# EAGLE design spdif_A (EAGLE 7.7.0)

## Sheet 1 of 2
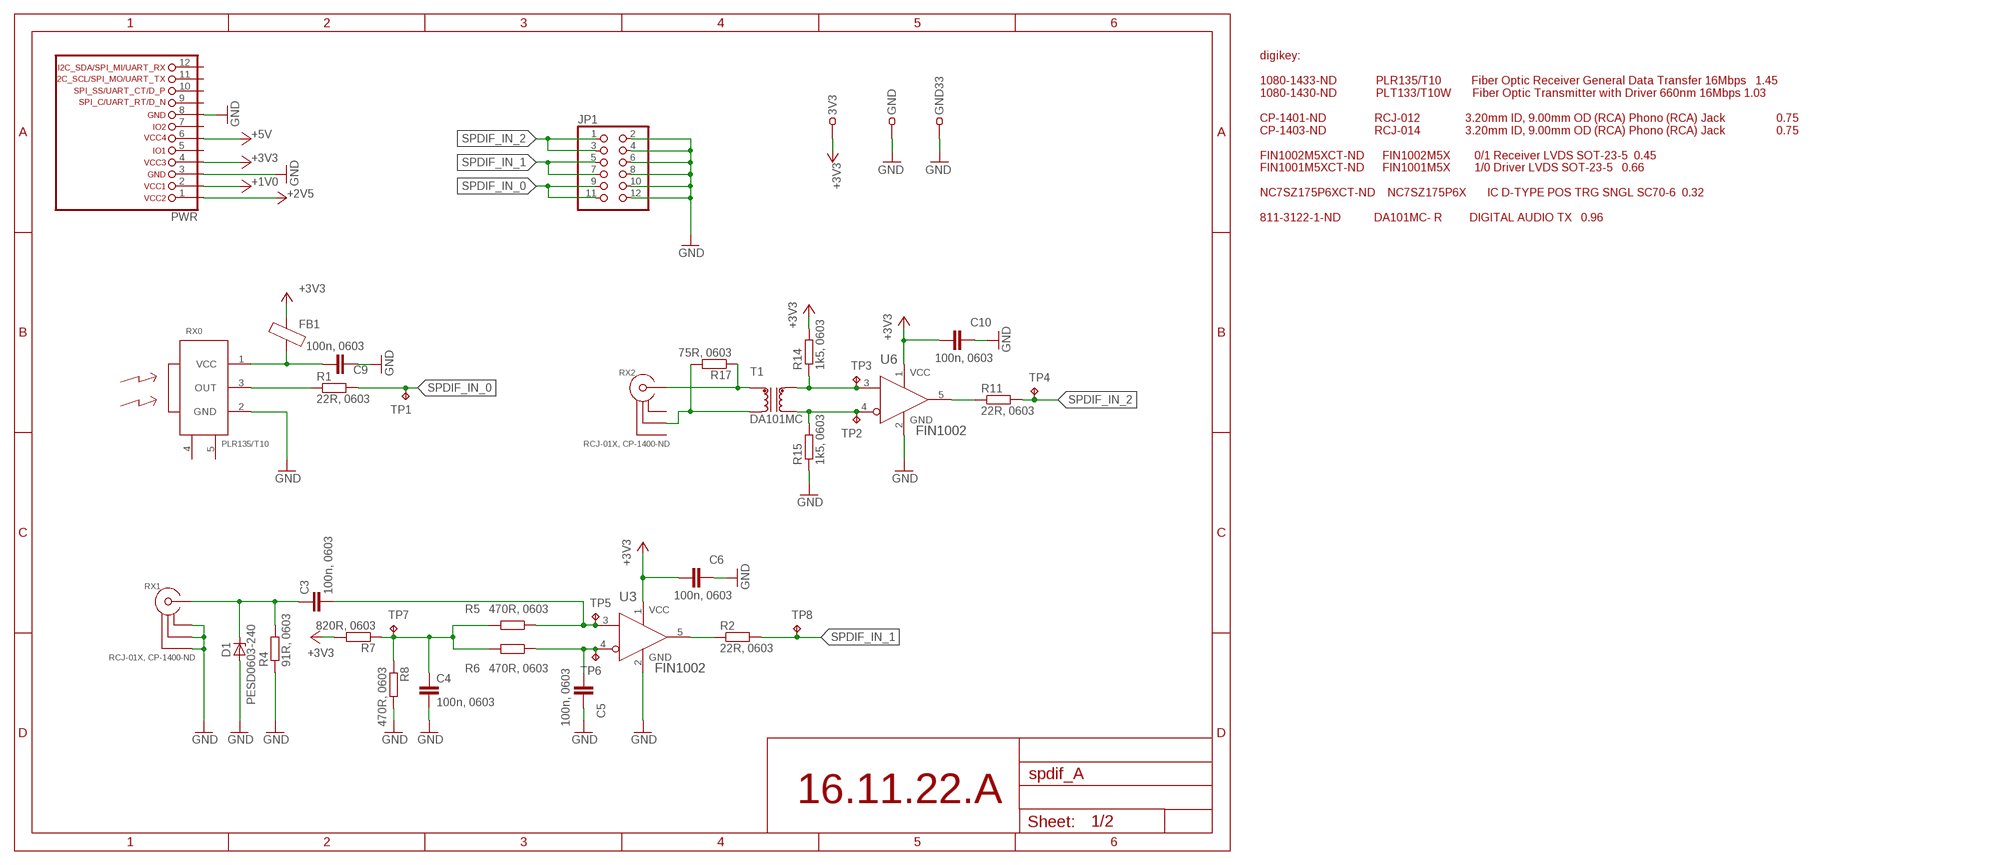
[diagram p0: schematic, sheet 1]

### Parts
3V3  TEST-22-MULTICOMP  [TEST_1MM]
C3  100n, 0603  C-EUC0603  [C0603]
C4  100n, 0603  C-EUC0603  [C0603]
C5  100n, 0603  C-EUC0603  [C0603]
C6  100n, 0603  C-EUC0603  [C0603]
C9  100n, 0603  C-EUC0603  [C0603]
C10  100n, 0603  C-EUC0603  [C0603]
D1  PESD0603-240  ZDPESD0603-240  [L0603]
FB1  FB_0603  [L0603]
GND  TEST-22-MULTICOMP  [TEST_1MM]
GND33  TEST-22-MULTICOMP  [TEST_1MM]
JP1  PINHD-2X6/90  [2X06/90]
PWR  LIWE_12_PIN_PWR7X7_COMPAT  [LIWE_12_PIN_7X7_COMPAT]
R1  22R, 0603  R-EU_R0603  [R0603]
R2  22R, 0603  R-EU_R0603  [R0603]
R4  91R, 0603  R-EU_R0603  [R0603]
R5  470R, 0603  R-EU_R0603  [R0603]
R6  470R, 0603  R-EU_R0603  [R0603]
R7  820R, 0603  R-EU_R0603  [R0603]
R8  470R, 0603  R-EU_R0603  [R0603]
R11  22R, 0603  R-EU_R0603  [R0603]
R14  1k5, 0603  R-EU_R0603  [R0603]
R15  1k5, 0603  R-EU_R0603  [R0603]
R17  75R, 0603  R-EU_R0603  [R0603]
RX0  PLR135/T10  PLR135_T10  [PLR135_T10]
RX1  RCJ-01X, CP-1400-ND  RCJ-01X  [RCJ-01X]
RX2  RCJ-01X, CP-1400-ND  RCJ-01X  [RCJ-01X]
T1  DA101MC  [DA101MC]
TP1  TPB1,27  [B1,27]
TP2  TPB1,27  [B1,27]
TP3  TPB1,27  [B1,27]
TP4  TPB1,27  [B1,27]
TP5  TPB1,27  [B1,27]
TP6  TPB1,27  [B1,27]
TP7  TPB1,27  [B1,27]
TP8  TPB1,27  [B1,27]
U3  FIN1002  [SOT95P280X140-5N]
U6  FIN1002  [SOT95P280X140-5N]

### Nets
+1V0: PWR.2
+2V5: PWR.1
+3V3: 3V3.1 C6.2 C10.2 FB1.2 PWR.4 R7.2 R14.2 U3.1(VCC) U6.1(VCC) ; also sheet 2
+5V: PWR.6
GND: C4.2 C5.1 C6.1 C9.1 C10.1 D1.1(A) GND33.1 GND.1 JP1.2 JP1.4 JP1.6 JP1.8 JP1.10 JP1.12 PWR.3 PWR.8 R4.1 R8.2 R15.1 RX0.2(GND) RX1.20(GND1) RX1.21(GND2) RX1.22(GND3) U3.2(GND) U6.2(GND) ; also sheet 2
N$3: R2.1 U3.5(ROUT)
N$4: C3.2 R5.1 TP5.TP U3.3(RIN+)
N$5: C9.2 FB1.1 RX0.1(VCC)
N$6: C3.1 D1.2(C) R4.2 RX1.1(SIG)
N$7: R11.1 U6.5(ROUT)
N$11: C4.1 R5.2 R6.2 R7.1 R8.1 TP7.TP
N$12: C5.2 R6.1 TP6.TP U3.4(RIN-)
N$16: R15.2 T1.4 TP2.TP U6.4(RIN-)
N$17: R14.1 T1.6 TP3.TP U6.3(RIN+)
N$20: R17.2 RX2.21(GND2) T1.3
N$21: R17.1 RX2.1(SIG) T1.1
SPDIF0_IN: R1.1 RX0.3(OUT)
SPDIF_IN_0: JP1.9 JP1.11 R1.2 TP1.TP
SPDIF_IN_1: JP1.5 JP1.7 R2.2 TP8.TP
SPDIF_IN_2: JP1.1 JP1.3 R11.2 TP4.TP
Unconnected: PWR.5 PWR.7 PWR.9 PWR.10 PWR.11 PWR.12 RX0.4(NC0) RX0.5(NC1) RX2.20(GND1) RX2.22(GND3)

### Notes on the sheet
- digikey: 
  
  1080-1433-ND             PLR135/T10          Fiber Optic Receiver General Data Transfer 16Mbps  	1.45
  1080-1430-ND             PLT133/T10W       Fiber Optic Transmitter with Driver 660nm 16Mbps	1.03
  
  CP-1401-ND                RCJ-012               3.20mm ID, 9.00mm OD (RCA) Phono (RCA) Jack                 0.75
  CP-1403-ND                RCJ-014               3.20mm ID, 9.00mm OD (RCA) Phono (RCA) Jack                 0.75
  
  FIN1002M5XCT-ND      FIN1002M5X        0/1 Receiver LVDS SOT-23-5		0.45
  FIN1001M5XCT-ND      FIN1001M5X        1/0 Driver LVDS SOT-23-5			0.66
  
  NC7SZ175P6XCT-ND    NC7SZ175P6X       IC D-TYPE POS TRG SNGL SC70-6		0.32
  
  811-3122-1-ND           DA101MC- R         DIGITAL AUDIO TX			0.96
- 16.11.22.A

## Sheet 2 of 2
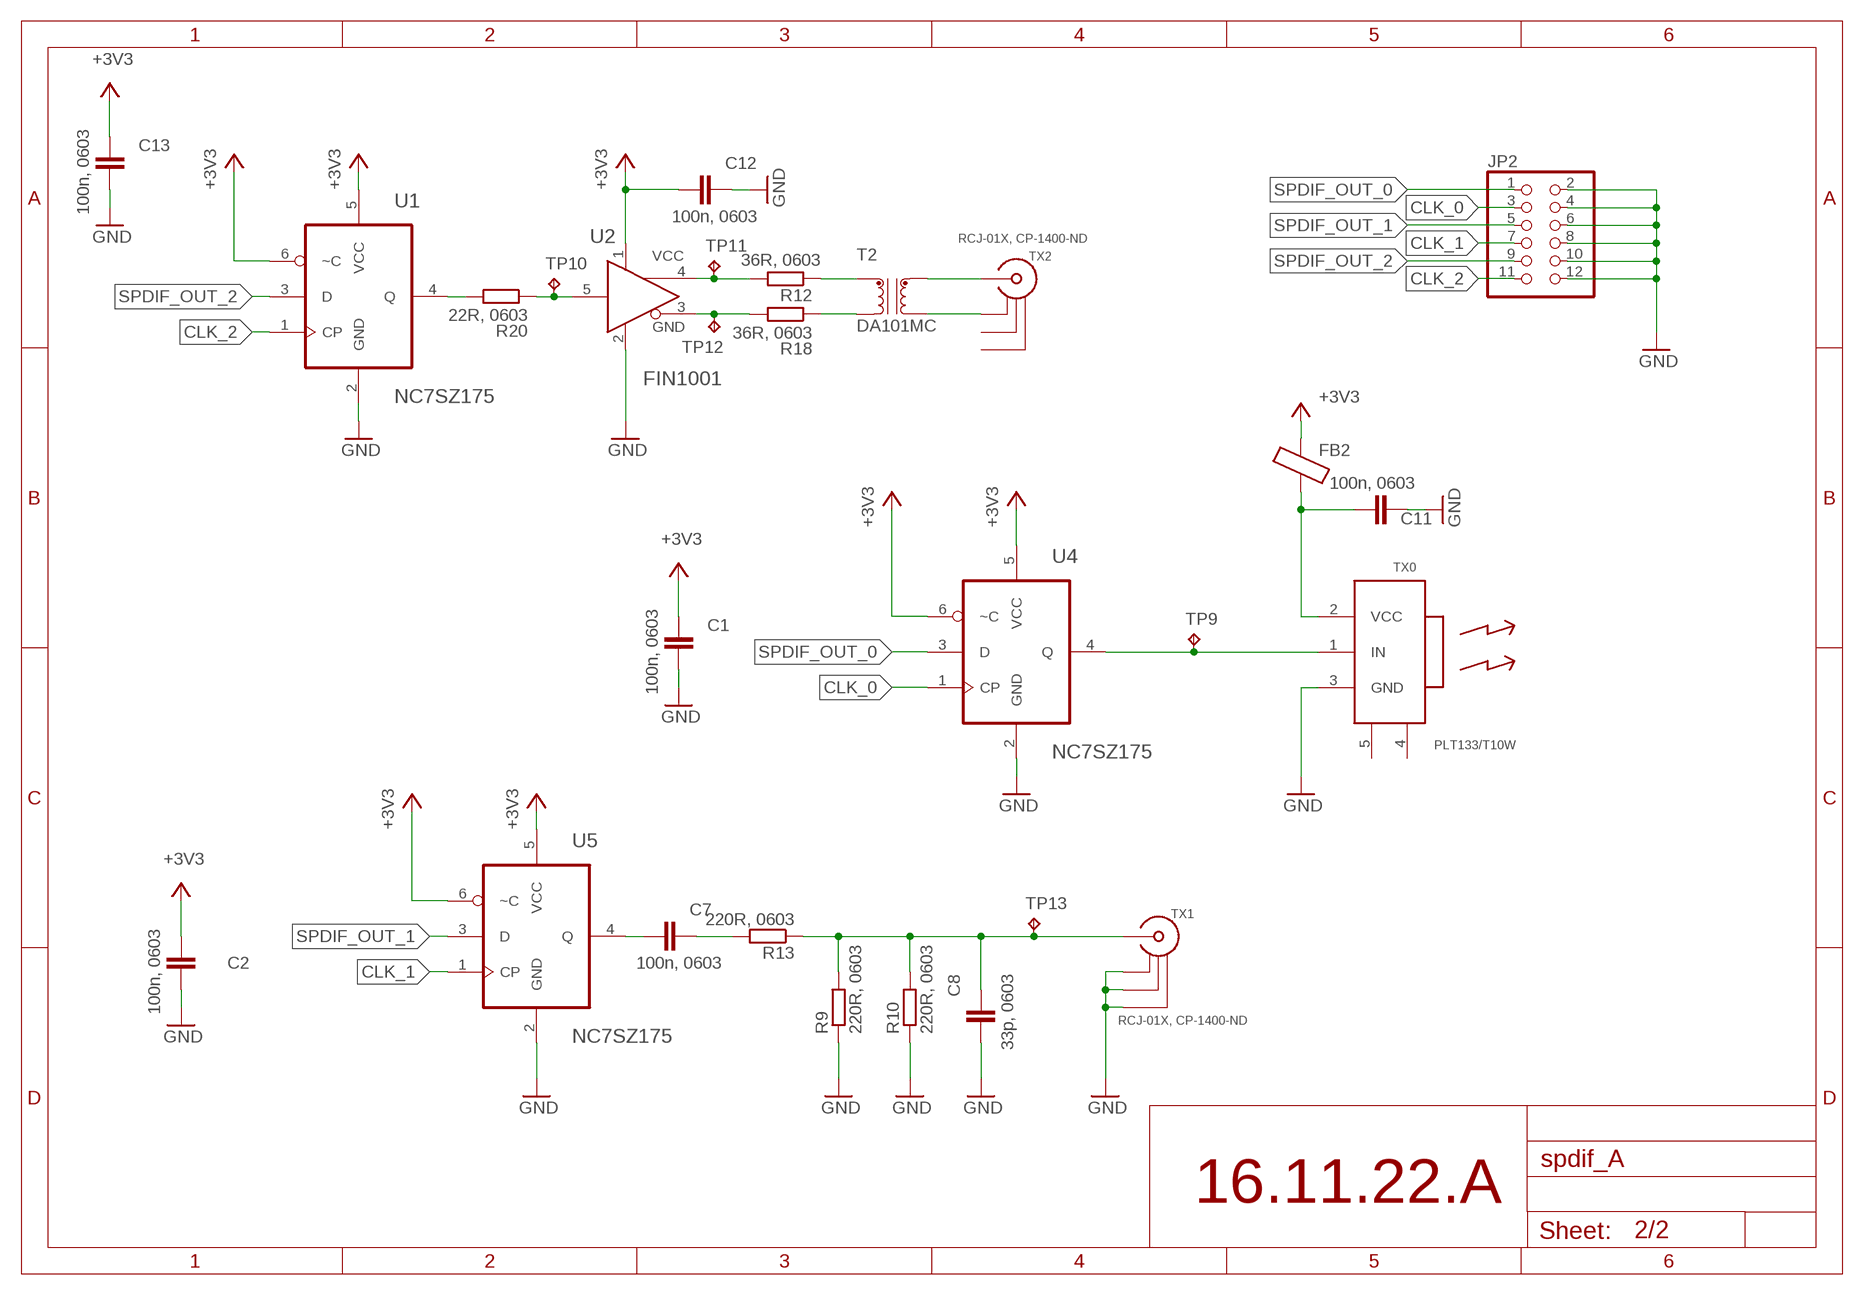
[diagram p1: schematic, sheet 2]

### Parts
C1  100n, 0603  C-EUC0603  [C0603]
C2  100n, 0603  C-EUC0603  [C0603]
C7  100n, 0603  C-EUC0603  [C0603]
C8  33p, 0603  C-EUC0603  [C0603]
C11  100n, 0603  C-EUC0603  [C0603]
C12  100n, 0603  C-EUC0603  [C0603]
C13  100n, 0603  C-EUC0603  [C0603]
FB2  FB_0603  [L0603]
JP2  PINHD-2X6/90  [2X06/90]
R9  220R, 0603  R-EU_R0603  [R0603]
R10  220R, 0603  R-EU_R0603  [R0603]
R12  36R, 0603  R-EU_R0603  [R0603]
R13  220R, 0603  R-EU_R0603  [R0603]
R18  36R, 0603  R-EU_R0603  [R0603]
R20  22R, 0603  R-EU_R0603  [R0603]
T2  DA101MC  [DA101MC]
TP9  TPB1,27  [B1,27]
TP10  TPB1,27  [B1,27]
TP11  TPB1,27  [B1,27]
TP12  TPB1,27  [B1,27]
TP13  TPB1,27  [B1,27]
TX0  PLT133/T10W  PLT133_T10W  [PLT133_T10W]
TX1  RCJ-01X, CP-1400-ND  RCJ-01X  [RCJ-01X]
TX2  RCJ-01X, CP-1400-ND  RCJ-01X  [RCJ-01X]
U1  NC7SZ175  [SOT65P210X110-6N]
U2  FIN1001  [SOT95P280X140-5N]
U4  NC7SZ175  [SOT65P210X110-6N]
U5  NC7SZ175  [SOT65P210X110-6N]

### Nets
+3V3: C1.2 C2.2 C12.2 C13.2 FB2.2 U1.5(VCC) U1.6(~C) U2.1(VCC) U4.5(VCC) U4.6(~C) U5.5(VCC) U5.6(~C) ; also sheet 1
CLK_0: JP2.3 U4.1(CP)
CLK_1: JP2.7 U5.1(CP)
CLK_2: JP2.11 U1.1(CP)
DA_N: R18.1 T2.3
DA_P: R12.1 T2.1
FIN_IN: R20.1 TP10.TP U2.5(RIN)
FIN_OUT_N: R18.2 TP12.TP U2.3(ROUT-)
FIN_OUT_P: R12.2 TP11.TP U2.4(ROUT+)
GND: C1.1 C2.1 C8.2 C11.1 C12.1 C13.1 JP2.2 JP2.4 JP2.6 JP2.8 JP2.10 JP2.12 R9.1 R10.1 TX0.3(GND) TX1.20(GND1) TX1.21(GND2) TX1.22(GND3) U1.2(GND) U2.2(GND) U4.2(GND) U5.2(GND) ; also sheet 1
N$8: C8.1 R9.2 R10.2 R13.1 TP13.TP TX1.1(SIG)
N$13: C7.1 R13.2
N$15: C7.2 U5.4(Q)
Q: R20.2 U1.4(Q)
SPDIF_OUT_0: JP2.1 U4.3(D)
SPDIF_OUT_1: JP2.5 U5.3(D)
SPDIF_OUT_2: JP2.9 U1.3(D)
TX0_IN: TP9.TP TX0.1(IN) U4.4(Q)
TX0_VCC: C11.2 FB2.1 TX0.2(VCC)
TX2_N: T2.4 TX2.20(GND1)
TX2_P: T2.6 TX2.1(SIG)
Unconnected: TX0.4(NC0) TX0.5(NC1) TX2.21(GND2) TX2.22(GND3)

### Notes on the sheet
- 16.11.22.A

## Library data of the parts
3V3 GND GND33 = 25cmsquare:TEST-22-MULTICOMP: MULTICOMP TEST-22 TEST PIN, PCB, 1.0MM FARNELL: 1702010
C1-C13 = rcl:C-EU: CAPACITOR, European symbol
D1 = 25cmsquare:ZD
FB1 FB2 = 25cmsquare:FB
JP1 JP2 = 25pinhead:PINHD-2X6: PIN HEADER
PWR = 25cmsquare:LIWE_12_PIN_PWR
R1 R2 R4-R15 R17 R18 R20 = rcl:R-EU_: RESISTOR, European symbol
RX0 = 25cmsquare:PLR135_T10
RX1 RX2 TX1 TX2 = 25cmsquare:RCJ-01X
T1 T2 = 25cmsquare:DA
TP1-TP13 = testpad:TP: Test pad
TX0 = 25cmsquare:PLT133_T10W
U1 U4 U5 = 25cmsquare:NC7SZ175
U2 = 25cmsquare:FIN1001
U3 U6 = 25cmsquare:FIN1002

## Board
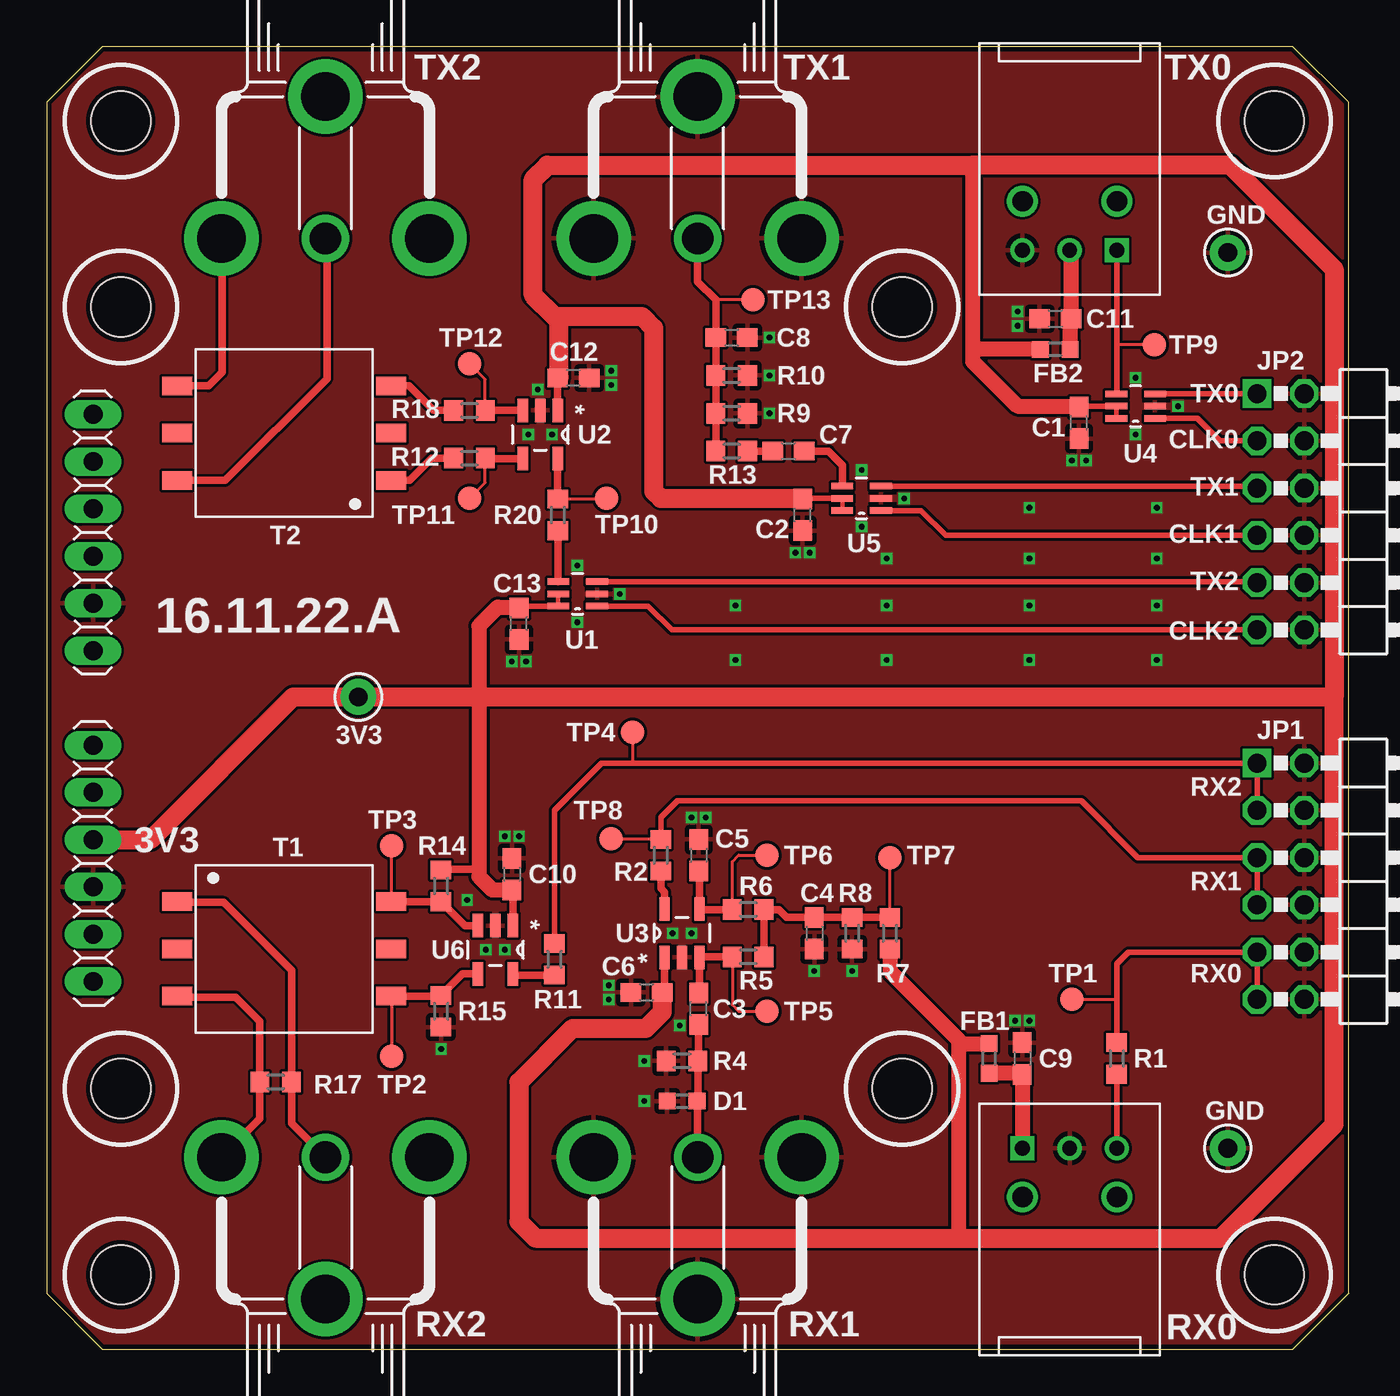
[diagram p2: board, top side]
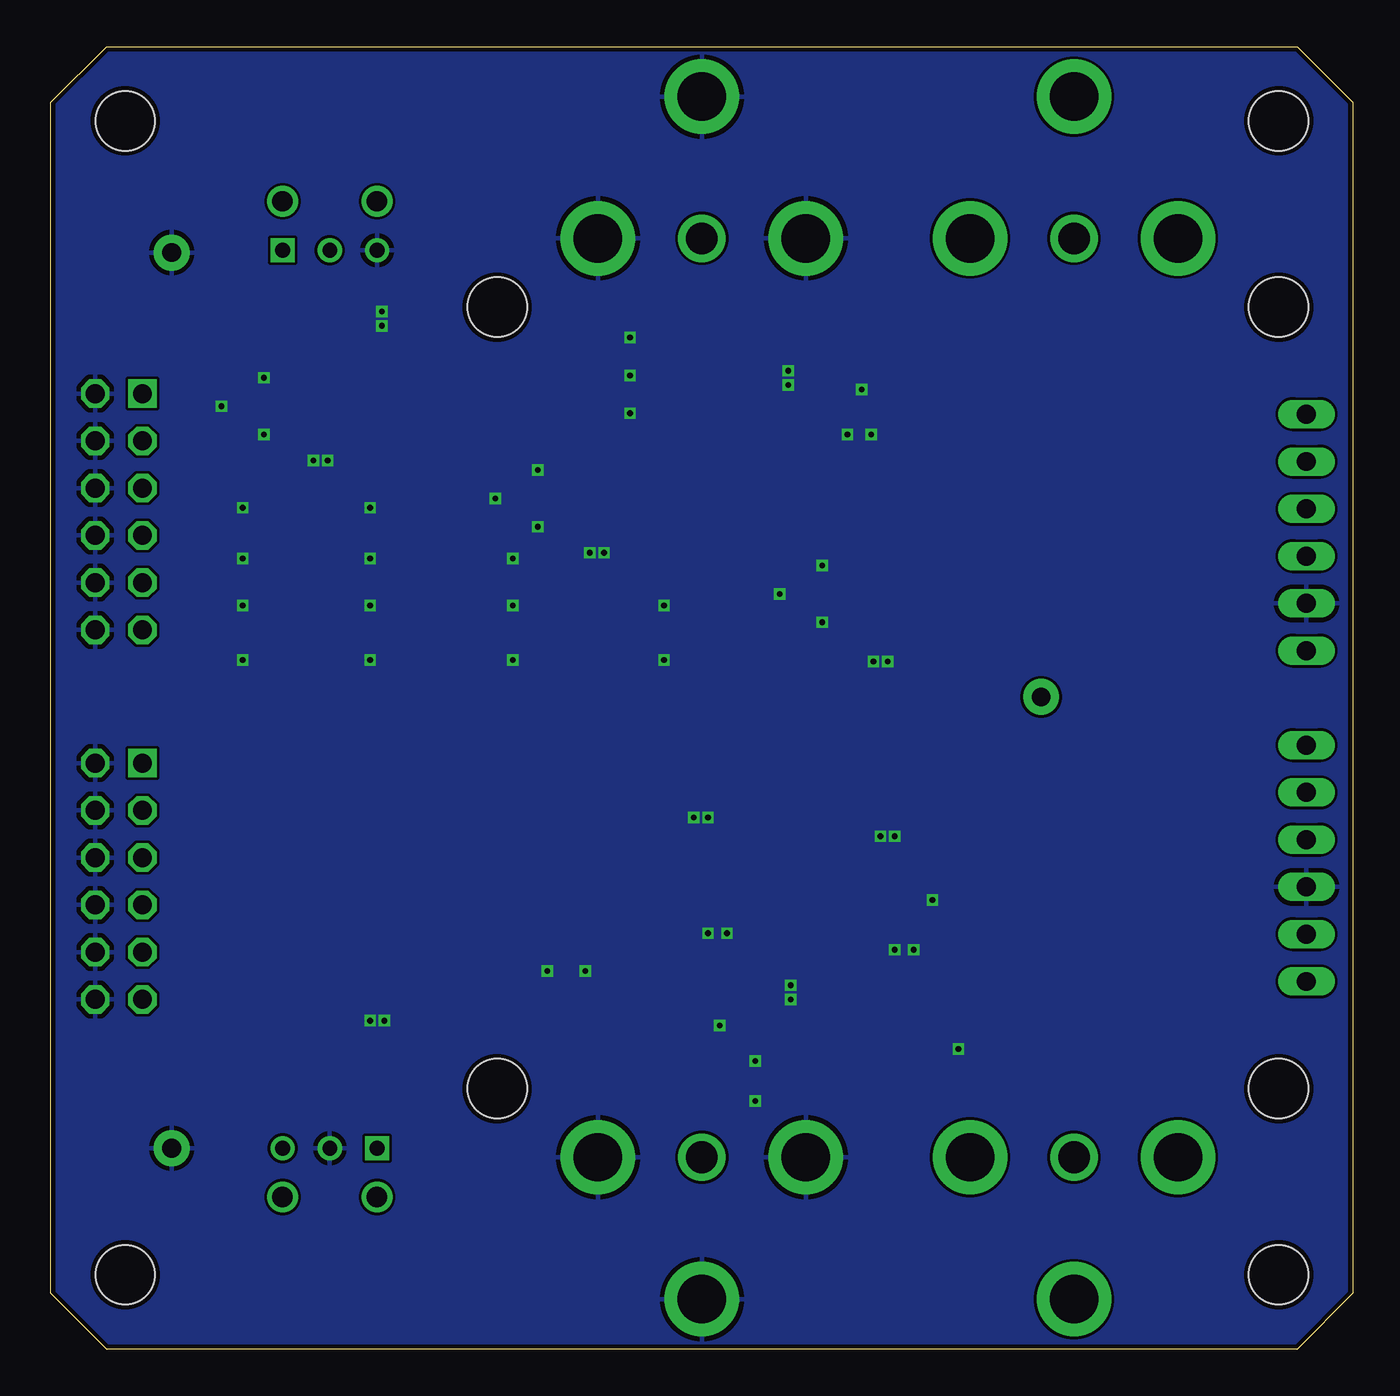
[diagram p3: board, bottom side, seen from below]

Size 70 x 70 mm. Coordinates in mm from the lower left corner, seen from the top.
Copper layers (1*16): Top 0.035mm / dielectric 1.5mm / Bottom 0.035mm
Design rules "SeeedStudio_2layer_DRU_no_angle_20140221": minimum track width 6mil, minimum drill 12mil, track to track 6mil, track to pad 6mil, pad to pad 6mil, via to via 6mil, smd to smd 0mil, copper to edge 10mil, drill to drill 10mil, minimum pad ring 10mil, minimum via ring 6mil, stop-mask expansion 2mil, vias tented up to drill 100mil, thermal gap 10mil

### Footprints (pad centres in the part's own frame; a part is rotated, then mirrored left to right if it is on the bottom)
TEST_1MM = drill 1 pad 1.93: 1 0,0
C0603 = smd 1.1 x 1: 1 -0.85,0; 2 0.85,0
L0603 = smd 0.9 x 0.9: 1 -0.8,0; 2 0.8,0
2X06/90 = drill 1.016 square: 1 -6.35,-6.35 | drill 1.016 octagon: 2 -6.35,-3.81; 3 -3.81,-6.35; 4 -3.81,-3.81; 5 -1.27,-6.35; 6 -1.27,-3.81; 7 1.27,-6.35; 8 1.27,-3.81; 9 3.81,-6.35; 10 3.81,-3.81; 11 6.35,-6.35; 12 6.35,-3.81
LIWE_12_PIN_7X7_COMPAT = drill 1.016 long: 1 67.5,50.24; 2 67.5,47.7; 3 67.5,45.16; 4 67.5,42.62; 5 67.5,40.08; 6 67.5,37.54; 7 67.5,32.46; 8 67.5,29.92; 9 67.5,27.38; 10 67.5,24.84; 11 67.5,22.3; 12 67.5,19.76 | hole 3.2: 24,14; 66,14; 24,56; 66,56; 4,66; 4,4; 66,4; 66,66
R0603 = smd 1 x 1.1: 1 -0.85,0; 2 0.85,0
PLR135_T10 = drill 0.8 square: 1 2.54,0 | drill 0.8: 2 0,0; 3 -2.54,0 | drill 1.1: 4 2.54,2.62; 5 -2.54,2.62
RCJ-01X = drill 1.7 pad 2.54: 1 0,0 | drill 2.6 pad 4: 20 -5.588,0; 21 5.588,0; 22 0,7.62
DA101MC = smd 1.6 x 1: 1 -5.75,2.54; 2 -5.75,0; 3 -5.75,-2.54; 4 5.75,-2.54; 5 5.75,0; 6 5.75,2.54
B1,27 = smd 1.27 x 1.27: TP 0,0
PLT133_T10W = drill 0.8 square: 1 2.54,0 | drill 0.8: 2 0,0; 3 -2.54,0 | drill 1.1: 4 2.54,2.63; 5 -2.54,2.63
SOT65P210X110-6N = smd 1.168 x 0.356: 1 -1.041,0.66; 2 -1.041,0; 3 -1.041,-0.66; 4 1.041,-0.66; 5 1.041,0; 6 1.041,0.66
SOT95P280X140-5N = smd 1.27 x 0.559: 1 -1.295,0.94; 2 -1.295,0; 3 -1.295,-0.94; 4 1.295,-0.94; 5 1.295,0.94

### Placement (x,y rotation side)
3V3  16.76,35.05 0 top
C1  55.5,49.78 90 top
C2  40.64,44.83 90 top
C3  35.05,18.29 90 top
C4  41.27,22.35 270 top
C5  35.05,26.54 270 top
C6  32.26,19.18 0 top
C7  39.88,48.26 0 top
C8  36.83,54.36 0 top
C9  52.45,15.62 270 top
C10  25.02,25.53 270 top
C11  54.23,55.37 0 top
C12  28.32,52.2 180 top
C13  25.4,38.99 90 top
D1  34.16,13.34 0 top
FB1  50.67,15.62 90 top
FB2  54.23,53.72 180 top
GND  63.5,10.79 0 top
GND33  63.5,58.93 0 top
JP1  71.42,25.15 270 top
JP2  71.42,45 270 top
PWR  70,70 180 top
R1  57.53,15.62 90 top
R2  33.02,26.54 90 top
R4  34.16,15.49 0 top
R5  37.72,21.08 0 top
R6  37.72,23.62 0 top
R7  45.34,22.35 270 top
R8  43.31,22.35 270 top
R9  36.83,50.29 180 top
R10  36.83,52.32 180 top
R11  27.3,20.95 90 top
R12  22.73,47.88 0 top
R13  36.83,48.26 0 top
R14  21.21,24.89 90 top
R15  21.21,18.16 90 top
R17  12.32,14.35 180 top
R18  22.73,50.44 0 top
R20  27.48,44.83 270 top
RX0  55,10.79 180 top
RX1  35,10.31 180 top
RX2  15,10.31 180 top
T1  12.78,21.51 0 top
T2  12.78,49.22 180 top
TP1  55.12,18.8 0 top
TP2  18.54,15.75 0 top
TP3  18.54,27.05 0 top
TP4  31.5,33.15 0 top
TP5  38.73,18.16 0 top
TP6  38.73,26.54 0 top
TP7  45.34,26.42 0 top
TP8  30.35,27.43 0 top
TP9  59.56,53.98 0 top
TP10  30.1,45.72 0 top
TP11  22.73,45.72 0 top
TP12  22.73,52.96 0 top
TP13  37.97,56.39 0 top
TX0  55,59.05 0 top
TX1  35,59.69 0 top
TX2  15,59.69 0 top
U1  28.55,40.59 180 top
U2  26.54,49.15 270 top
U3  34.16,22.35 90 top
U4  58.55,50.67 180 top
U5  43.81,45.72 180 top
U6  24.13,21.46 270 top

### Tracks (layer width: path | path; a pad name or v marks a point on that pad's centre or on a via)
+3V3
  Top 0.254: U1.6 U1.5 | U5.5 U5.6 | U4.5 U4.6
  Top 0.305: U5.5 40.68,45.72 arc90 C2.2 | U1.6 25.11,39.93 C13.2 | U4.5 55.41,50.67 C1.2
  Top 0.406: U2.1 27.47,50.46 C12.2 | R14.2 21.25,25.78 23.24,25.78 | C10.2 25.07,24.63 U6.1 | U3.1 33.22,19.14 C6.2
  Top 0.813: C13.2 24.98,39.88 24.26,39.88 23.24,38.86 23.24,35.05 23.24,25.78 23.24,25.4 23.96,24.68 C10.2 | R7.2 45.34,20.32 49.02,16.64 49.02,16.38 | 49.02,16.38 49.02,5.97 | FB1.2 50.63,16.38 49.02,16.38 | 49.78,63.63 49.78,53.72 | 49.78,53.72 49.78,53.09 52.2,50.67 55.33,50.67 | FB2.2 49.78,53.72
  Top 1.016: PWR.4 5.59,27.38 13.26,35.05 3V3.1 23.24,35.05 69.22,35.05 | 69.22,35.05 69.22,58.04 63.63,63.63 49.78,63.63 26.92,63.63 26.16,62.87 26.16,56.64 27.3,55.5 27.56,55.5 | 69.22,35.05 69.22,12.06 63.12,5.97 49.02,5.97 26.29,5.97 25.4,6.86 25.4,14.35 28.28,17.23 32.22,17.23 33.11,18.12 C6.2 | 27.56,55.5 32,55.5 32.64,54.86 32.64,46.1 33.02,45.72 40.6,45.72 C2.2 | C12.2 27.56,52.24 27.56,55.5 | 55.33,50.67 C1.2
CLK_0
  Top 0.305: JP2.3 63.08,48.81 61.87,50.01 U4.1
CLK_1
  Top 0.305: JP2.7 48.34,43.73 47.02,45.06 U5.1
CLK_2
  Top 0.305: U1.1 32.33,39.93 33.61,38.65 JP2.11
DA_N
  Top 0.406: T2.3 19.48,51.76 20.8,50.44 R18.1
DA_P
  Top 0.406: T2.1 19.51,46.68 20.7,47.88 R12.1
FIN_IN
  Top 0.152: TP10.TP 30.06,45.68 R20.1
  Top 0.406: U2.5 R20.1
FIN_OUT_N
  Top 0.152: R18.2 23.58,52.11 TP12.TP
  Top 0.406: U2.3 R18.2
FIN_OUT_P
  Top 0.152: TP11.TP 23.58,46.57 R12.2
  Top 0.406: U2.4 23.61,47.85 arc-90 R12.2
GND  (via drill 0.3)
  other vias: 30.35,52.58 30.35,51.82 38.86,54.36 38.86,52.32 38.86,50.29 40.26,42.8 41.02,42.8 46.1,45.72 52.83,45.21 59.69,45.21 60.83,50.67 30.81,40.59 37.03,39.95 45.16,39.95 52.83,39.95 59.69,39.95 37.03,37.03 45.16,37.03 52.83,37.03 59.69,37.03 25.02,36.96 25.78,36.96 45.16,42.49 52.83,42.49 59.69,42.49 52.2,55.75 52.2,54.99 58.55,52.2 58.55,49.15 26.42,51.56 25.91,49.15 28.52,42.11 28.52,39.07 43.81,47.24 43.81,44.2 55.88,47.75 55.12,47.75 24.64,27.56 25.4,27.56 24.64,21.46 22.61,24.13 21.21,16.13 34.67,28.57 35.43,28.57 30.23,19.56 30.23,18.8 33.66,22.35 34.04,17.4 34.67,22.35 27.18,49.15 23.62,21.46 32.13,15.49 32.13,13.34 41.27,20.32 43.31,20.32 52.83,17.65 52.07,17.65
  pour Bottom: -3.56,-2.79 -3.81,73.41 73.53,73.28 73.79,-2.92
  pour Top (rank 6): -1.78,-1.78 -1.65,71.5 72.14,71.37 72.01,-1.91
  pour Top (no thermals): 58.42,50.04 58.42,51.18 58.8,51.18 58.8,50.8 60.45,50.8 60.45,50.55 58.8,50.55 58.8,50.04
  pour Top (no thermals): 26.04,51.44 27.05,51.44 27.05,51.18 26.67,51.18 26.67,49.66 27.18,49.66 27.18,49.4 26.04,49.4 26.04,49.66 26.42,49.66 26.42,51.18 26.04,51.18
  pour Top (no thermals): 28.45,41.02 28.83,41.02 28.83,40.64 30.48,40.64 30.48,40.51 28.83,40.51 28.83,40.26 28.45,40.26
  pour Top (no thermals): 43.81,46.1 44.07,46.1 44.07,45.85 45.85,45.85 45.85,45.59 44.07,45.59 44.07,45.34 43.81,45.34
  pour Top (no thermals): 23.5,23.62 24,23.62 24,21.97 23.62,21.97 23.62,21.72 24.77,21.72 24.77,21.97 24.26,21.97 24.26,23.62 24.64,23.62 24.64,23.88 23.5,23.88
  pour Top (no thermals): 33.4,22.23 33.4,21.84 34.04,21.84 34.04,20.32 33.66,20.32 33.66,20.07 34.67,20.07 34.67,20.32 34.29,20.32 34.29,21.84 34.8,21.84 34.8,22.23
N$3
  Top 0.406: U3.5 33.22,24.56 33.02,24.77 R2.1
N$4
  Top 0.152: R5.1 36.87,18.5 37.21,18.16 TP5.TP
  Top 0.406: C3.2 35.1,19.19 U3.3 35.13,21.08 R5.1
N$5
  Top 0.406: C9.2 52.4,14.82
  Top 0.813: C9.2 RX0.1 | 52.4,14.82 FB1.1
N$6
  Top 0.406: RX1.1 35,13.3 D1.2 35.01,13.38 R4.2 35.05,15.53 C3.1
N$7
  Top 0.406: U6.5 25.13,20.11 R11.1
N$8
  Top 0.152: TP13.TP 35.98,56.39
  Top 0.406: R13.1 R9.2 R10.2 C8.1 35.98,56.39 35,57.37 TX1.1
N$11
  Top 0.152: R7.1 TP7.TP
  Top 0.406: R5.2 R6.2 39.37,23.62 39.79,23.2 C4.1 R8.1 R7.1
N$12
  Top 0.152: R6.1 36.87,26.2 37.21,26.54 TP6.TP
  Top 0.406: R6.1 35.13,23.62 U3.4 35.1,25.69 C5.2
N$13
  Top 0.406: R13.2 C7.1
N$15
  Top 0.152: 42.8,46.53 42.8,46.41 U5.4
  Top 0.406: C7.2 42.04,48.26 42.8,47.5 42.8,46.53
N$16
  Top 0.152: T1.4 18.54,18.96 TP2.TP
  Top 0.406: U6.4 22.37,20.17 R15.2 21.17,18.97 T1.4
N$17
  Top 0.152: T1.6 18.54,24.07 TP3.TP
  Top 0.406: T1.6 R14.1 22.49,22.76 U6.3
N$20
  Top 0.406: T1.3 7.08,18.92 10.16,18.92 11.47,17.61 R17.2 11.47,12.37 RX2.21
N$21
  Top 0.406: T1.1 7.08,24 9.53,24 13.17,20.36 R17.1 13.17,12.14 RX2.1
Q
  Top 0.305: 27.52,41.26 U1.4
  Top 0.406: R20.2 27.51,43.96 U1.4
SPDIF0_IN
  Top 0.305: 57.53,10.8 R1.1
  Top 0.406: RX0.3 57.53,10.8
SPDIF_IN_0
  Top 0.152: TP1.TP 57.53,18.8
  Top 0.305: R1.2 57.53,18.8 57.53,20.7 58.17,21.34 JP1.9 JP1.11
SPDIF_IN_1
  Top 0.152: TP8.TP 32.98,27.43 R2.2
  Top 0.305: R2.2 33.02,28.57 33.91,29.46 55.63,29.46 58.67,26.42 JP1.5 JP1.7
SPDIF_IN_2
  Top 0.152: TP4.TP 31.5,31.5
  Top 0.305: R11.2 27.3,28.96 29.84,31.5 31.5,31.5 JP1.1 JP1.3
SPDIF_OUT_0
  Top 0.305: U4.3 64.96,51.33 JP2.1
SPDIF_OUT_1
  Top 0.305: U5.3 64.95,46.38 JP2.5
SPDIF_OUT_2
  Top 0.305: U1.3 64.95,41.25 JP2.9
TX0_IN
  Top 0.152: TP9.TP 57.67,53.98 57.54,53.85
  Top 0.305: TX0.1 57.54,53.85 57.54,51.37 U4.4
TX0_VCC
  Top 0.813: 55,59.06 TX0.2 55.08,58.98 C11.2 55.03,55.32 FB2.1
TX2_N
  Top 0.406: TX2.20 9.44,57.95 9.44,52.49 8.71,51.76 T2.4
TX2_P
  Top 0.305: 15.07,59.52 15,59.6 TX2.1
  Top 0.406: T2.6 9.6,46.68 15.07,52.16 15.07,59.52

### Text on the board
tNames: GND | TX0 | CLK0 | TX1 | CLK1 | TX2 | 16.11.22.A | CLK2 | RX2 | 3V3 | RX1 | RX0